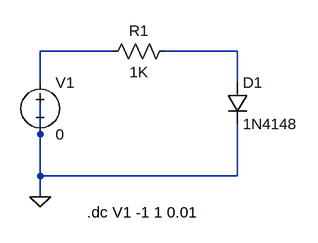
[diagram p0: schematic Ideal vs Practical Diode Models.asc]
Ideal vs Practical Diode Models.asc, the LTspice schematic file:
Version 4.1
SHEET 1 968 680
WIRE 160 64 48 64
WIRE 352 64 240 64
WIRE 48 112 48 64
WIRE 352 112 352 64
WIRE 48 192 48 128
WIRE 48 256 48 192
WIRE 352 256 352 176
WIRE 352 256 48 256
WIRE 48 288 48 256
FLAG 48 288 0
SYMBOL voltage 48 96 R0
SYMATTR InstName V1
SYMATTR Value 0
SYMBOL res 256 48 R90
WINDOW 0 0 56 VBottom 2
WINDOW 3 32 56 VTop 2
SYMATTR InstName R1
SYMATTR Value 1K
SYMBOL diode 336 112 R0
SYMATTR InstName D1
SYMATTR Value 1N4148
TEXT 120 312 Left 2 !.dc V1 -1 1 0.01

The netlist it stands for:
* Ideal vs Practical Diode Models.asc
V1 N001 0 0
R1 N002 N001 1K
D1 N002 0 1N4148
.model D D
.lib standard.dio
.dc V1 -1 1 0.01
.backanno
.end